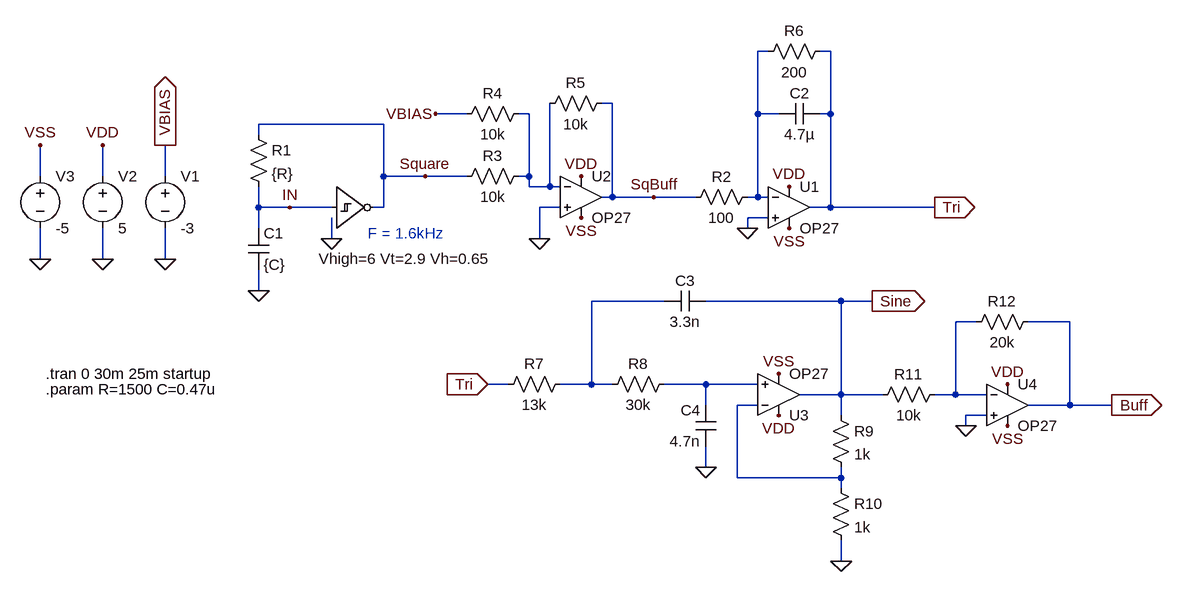
[diagram p0: schematic FullOscillator.asc]
FullOscillator.asc, the LTspice schematic file:
Version 4
SHEET 1 1340 772
WIRE 304 -32 288 -32
WIRE 400 -32 384 -32
WIRE 64 48 48 48
WIRE -160 64 -208 64
WIRE -64 64 -80 64
WIRE 288 64 288 -32
WIRE 320 64 288 64
WIRE 400 64 400 -32
WIRE 400 64 384 64
WIRE -288 80 -480 80
WIRE -480 96 -480 80
WIRE -816 160 -816 112
WIRE -720 160 -720 112
WIRE -624 160 -624 112
WIRE -288 160 -288 80
WIRE -224 160 -288 160
WIRE -160 160 -224 160
WIRE -64 160 -64 64
WIRE -64 160 -80 160
WIRE -64 176 -64 160
WIRE -32 176 -32 48
WIRE -32 176 -64 176
WIRE -16 176 -32 176
WIRE 64 192 64 48
WIRE 64 192 48 192
WIRE 128 192 64 192
WIRE 192 192 128 192
WIRE 288 192 288 64
WIRE 288 192 272 192
WIRE 304 192 288 192
WIRE -480 208 -480 176
WIRE -432 208 -480 208
WIRE -368 208 -432 208
WIRE -288 208 -288 160
WIRE -288 208 -304 208
WIRE -16 208 -48 208
WIRE 400 208 400 64
WIRE 400 208 368 208
WIRE 560 208 400 208
WIRE 304 224 272 224
WIRE -480 240 -480 208
WIRE 272 240 272 224
WIRE -368 256 -368 224
WIRE -48 256 -48 208
WIRE -816 288 -816 240
WIRE -720 288 -720 240
WIRE -624 288 -624 240
WIRE -480 336 -480 304
WIRE 144 352 32 352
WIRE 416 352 208 352
WIRE 464 352 416 352
WIRE 624 384 592 384
WIRE 768 384 704 384
WIRE -96 480 -128 480
WIRE 32 480 32 352
WIRE 32 480 -16 480
WIRE 64 480 32 480
WIRE 208 480 144 480
WIRE 288 480 208 480
WIRE 416 496 416 352
WIRE 416 496 352 496
WIRE 480 496 416 496
WIRE 592 496 592 384
WIRE 592 496 560 496
WIRE 640 496 592 496
WIRE 208 512 208 480
WIRE 288 512 256 512
WIRE 768 512 768 384
WIRE 768 512 704 512
WIRE 832 512 768 512
WIRE 416 528 416 496
WIRE 640 528 608 528
WIRE 608 544 608 528
WIRE 208 608 208 576
WIRE 256 624 256 512
WIRE 416 624 416 608
WIRE 416 624 256 624
WIRE 416 640 416 624
WIRE 416 752 416 720
FLAG -368 256 0
FLAG -480 336 0
FLAG -432 208 IN
FLAG 272 240 0
FLAG 128 192 SqBuff
FLAG -48 256 0
FLAG -624 288 0
FLAG -624 112 VBIAS
IOPIN -624 112 Out
FLAG -208 64 VBIAS
FLAG -720 288 0
FLAG -816 288 0
FLAG 336 176 VDD
FLAG 336 240 VSS
FLAG -224 160 Square
FLAG 16 160 VDD
FLAG 16 224 VSS
FLAG -720 112 VDD
FLAG -816 112 VSS
FLAG 320 528 VDD
FLAG 320 464 VSS
FLAG 464 352 Sine
IOPIN 464 352 Out
FLAG 208 608 0
FLAG 416 752 0
FLAG 560 208 Tri
IOPIN 560 208 Out
FLAG -128 480 Tri
IOPIN -128 480 In
FLAG 608 544 0
FLAG 672 480 VDD
FLAG 672 544 VSS
FLAG 832 512 Buff
IOPIN 832 512 Out
SYMBOL res -496 80 R0
SYMATTR InstName R1
SYMATTR Value {R}
SYMBOL cap -496 240 R0
SYMATTR InstName C1
SYMATTR Value {C}
SYMBOL Digital\\schmtinv -368 144 R0
WINDOW 0 8 32 Invisible 2
WINDOW 123 -20 143 Left 2
SYMATTR InstName A1
SYMATTR Value2 Vhigh=6 Vt=2.9 Vh=0.65
SYMATTR SpiceLine Td=12n
SYMBOL res 288 176 R90
WINDOW 0 0 56 VBottom 2
WINDOW 3 32 56 VTop 2
SYMATTR InstName R2
SYMATTR Value 100
SYMBOL cap 384 48 R90
WINDOW 0 0 32 VBottom 2
WINDOW 3 32 32 VTop 2
SYMATTR InstName C2
SYMATTR Value 4.7µ
SYMBOL res -64 144 R90
WINDOW 0 0 56 VBottom 2
WINDOW 3 32 56 VTop 2
SYMATTR InstName R3
SYMATTR Value 10k
SYMBOL res -64 48 R90
WINDOW 0 0 56 VBottom 2
WINDOW 3 32 56 VTop 2
SYMATTR InstName R4
SYMATTR Value 10k
SYMBOL res 64 32 R90
WINDOW 0 0 56 VBottom 2
WINDOW 3 32 56 VTop 2
SYMATTR InstName R5
SYMATTR Value 10k
SYMBOL voltage -624 144 R0
WINDOW 123 0 0 Left 2
WINDOW 39 0 0 Left 2
SYMATTR InstName V1
SYMATTR Value -3
SYMBOL Opamps\\OP27 336 144 R0
SYMATTR InstName U1
SYMBOL voltage -720 144 R0
SYMATTR InstName V2
SYMATTR Value 5
SYMBOL voltage -816 144 R0
SYMATTR InstName V3
SYMATTR Value -5
SYMBOL res 400 -48 R90
WINDOW 0 0 56 VBottom 2
WINDOW 3 32 56 VTop 2
SYMATTR InstName R6
SYMATTR Value 200
SYMBOL Opamps\\OP27 16 128 R0
SYMATTR InstName U2
SYMBOL res 0 464 R90
WINDOW 0 0 56 VBottom 2
WINDOW 3 32 56 VTop 2
SYMATTR InstName R7
SYMATTR Value 13k
SYMBOL res 160 464 R90
WINDOW 0 0 56 VBottom 2
WINDOW 3 32 56 VTop 2
SYMATTR InstName R8
SYMATTR Value 30k
SYMBOL cap 208 336 R90
WINDOW 0 0 32 VBottom 2
WINDOW 3 32 32 VTop 2
SYMATTR InstName C3
SYMATTR Value 3.3n
SYMBOL cap 224 576 R180
WINDOW 0 24 56 Left 2
WINDOW 3 24 8 Left 2
SYMATTR InstName C4
SYMATTR Value 4.7n
SYMBOL Opamps\\OP27 320 560 M180
SYMATTR InstName U3
SYMBOL res 400 512 R0
SYMATTR InstName R9
SYMATTR Value 1k
SYMBOL res 400 624 R0
SYMATTR InstName R10
SYMATTR Value 1k
SYMBOL Opamps\\OP27 672 448 R0
SYMATTR InstName U4
SYMBOL res 576 480 R90
WINDOW 0 0 56 VBottom 2
WINDOW 3 32 56 VTop 2
SYMATTR InstName R11
SYMATTR Value 10k
SYMBOL res 720 368 R90
WINDOW 0 0 56 VBottom 2
WINDOW 3 32 56 VTop 2
SYMATTR InstName R12
SYMATTR Value 20k
TEXT -312 248 Left 2 ;F = 1.6kHz
TEXT -808 464 Left 2 !.tran 0 30m 25m startup
TEXT -808 488 Left 2 !.param R=1500 C=0.47u

The netlist it stands for:
* FullOscillator.asc
R1 Square IN {R}
C1 IN 0 {C}
A1 IN 0 0 0 0 Square 0 0 SCHMITT Vhigh=6 Vt=2.9 Vh=0.65 Td=12n
R2 N001 SqBuff 100
C2 Tri N001 4.7µ
R3 N002 Square 10k
R4 N002 VBIAS 10k
R5 SqBuff N002 10k
V1 VBIAS 0 -3
XU1 0 N001 VDD VSS Tri OP27  ; pins In+ In- V+ V- OUT
V2 VDD 0 5
V3 VSS 0 -5
R6 Tri N001 200
XU2 0 N002 VDD VSS SqBuff OP27  ; pins In+ In- V+ V- OUT
R7 N003 Tri 13k
R8 N005 N003 30k
C3 Sine N003 3.3n
C4 0 N005 4.7n
XU3 N005 N006 VDD VSS Sine OP27  ; pins In+ In- V+ V- OUT
R9 Sine N006 1k
R10 N006 0 1k
XU4 0 N004 VDD VSS Buff OP27  ; pins In+ In- V+ V- OUT
R11 N004 Sine 10k
R12 Buff N004 20k
* F = 1.6kHz
.tran 0 30m 25m startup
.param R=1500 C=0.47u
.lib ADI.lib
.backanno
.end